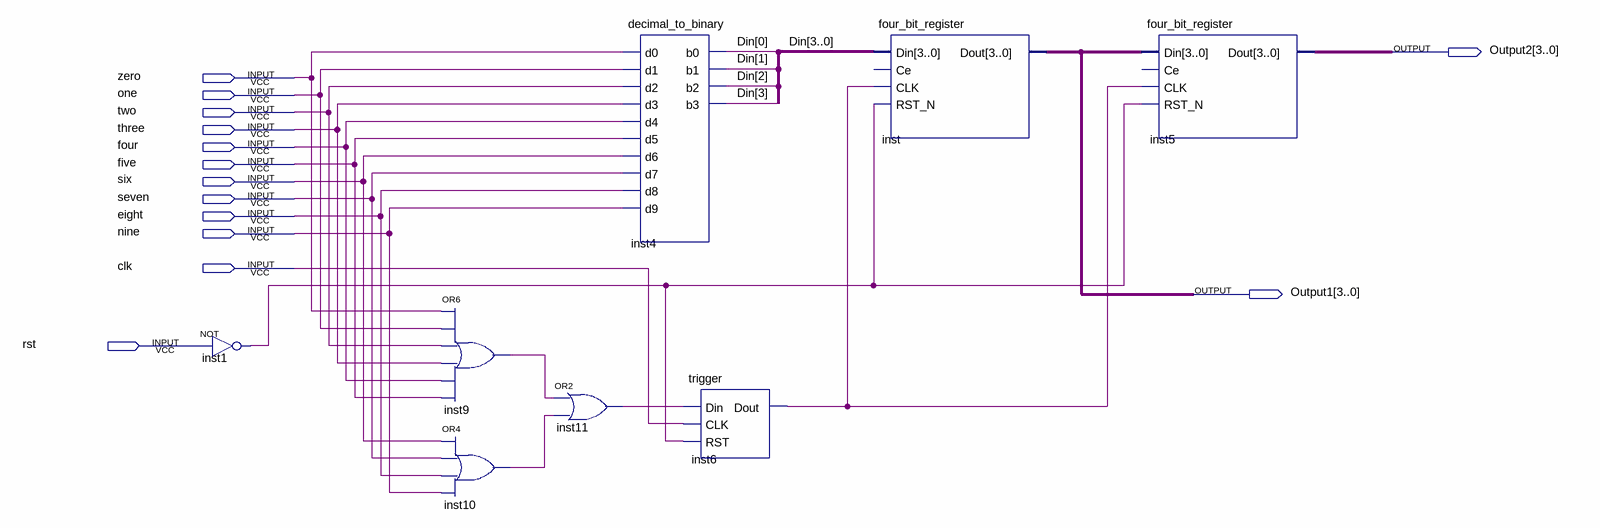
[diagram p0: schematic sheet]
// Quartus schematic work2.bdf as structural Verilog: 8 symbols, 14 pins
module work2 (
  input  zero,
  input  one,
  input  two,
  input  three,
  input  four,
  input  five,
  input  six,
  input  seven,
  input  eight,
  input  nine,
  input  clk,
  input  rst,
  output [3:0] Output2,
  output [3:0] Output1
);

  wire inst1_out, inst6_dout, inst9_out, inst10_out, inst11_out;
  wire [3:0] Din;

  not inst1 (inst1_out, rst);
  or inst9 (inst9_out, zero, one, two, three, four, five);
  or inst10 (inst10_out, six, seven, eight, nine);
  or inst11 (inst11_out, inst9_out, inst10_out);
  decimal_to_binary inst4 (
    .d0(zero), .d1(one), .d2(two), .d3(three), .d4(four), .d5(five), .d6(six), .d7(seven), .d8(eight),
    .d9(nine), .b0(Din[0]), .b1(Din[1]), .b2(Din[2]), .b3(Din[3]));
  trigger inst6 (.Din(inst11_out), .CLK(clk), .RST(inst1_out), .Dout(inst6_dout));
  four_bit_register inst (.Din(Din), .CLK(inst6_dout), .RST_N(inst1_out), .Dout(Output1));  // open: Ce
  four_bit_register inst5 (.Din(Output1), .CLK(inst6_dout), .RST_N(inst1_out), .Dout(Output2));  // open: Ce
endmodule
